# EAGLE design MQ-135_Matheus_Rossetti_-_14205347 (EAGLE 9.6.2)
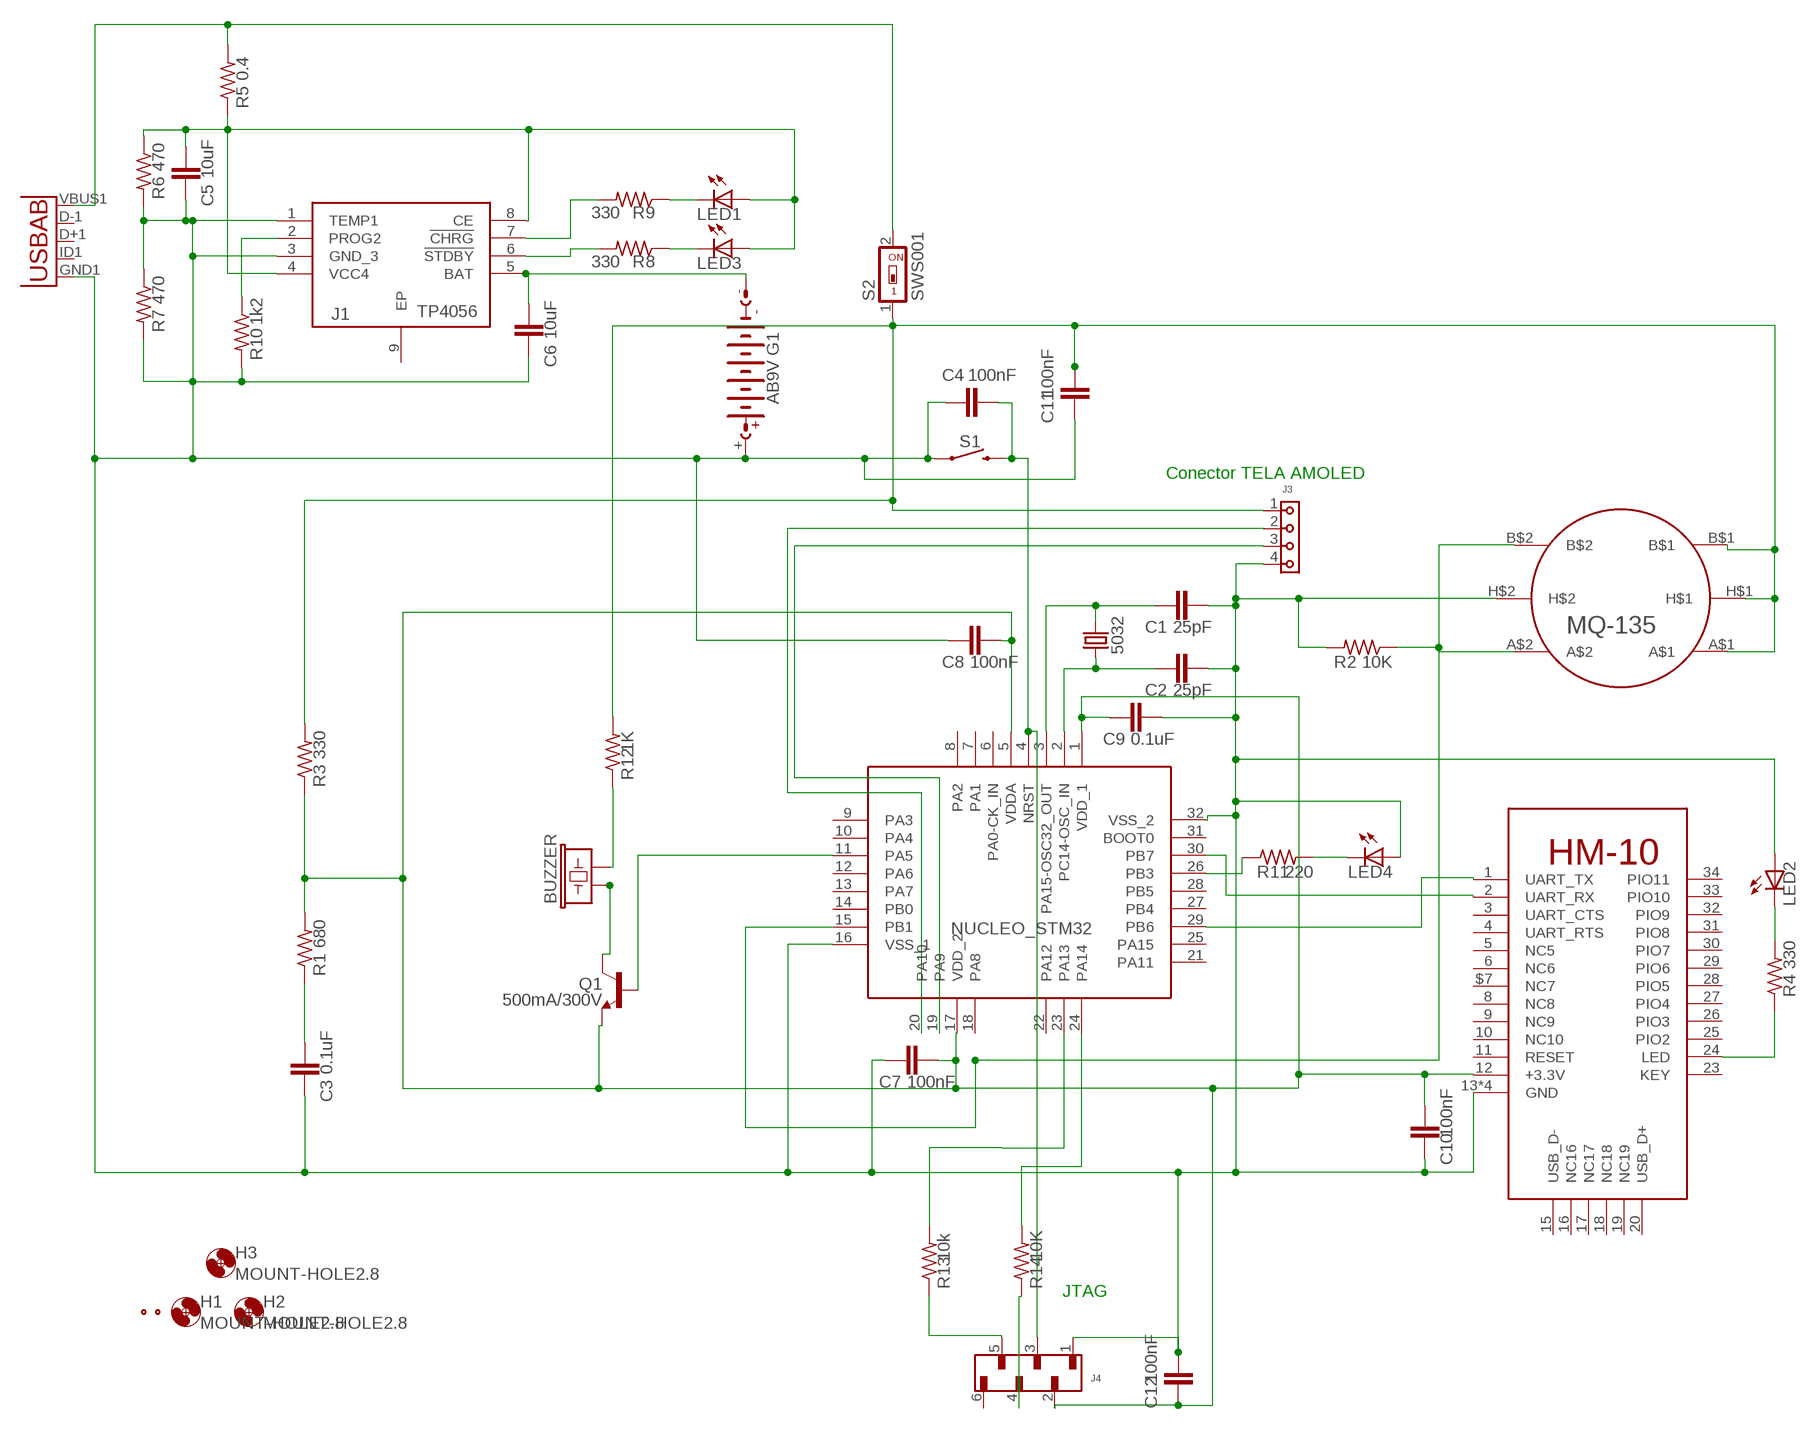
[diagram p0: schematic, sheet 1]

## Parts
BT_SENSOR  HM-10-BOARD  [26.9X13X2.2_BOARD]
C1  25pF  CC0805KRX7R9BB104  [CAP_0805]
C2  25pF  CC0805KRX7R9BB104  [CAP_0805]
C3  0.1uF  CC0805KRX7R9BB104  [CAP_0805]
C4  100nF  CC0805KRX7R9BB104  [CAP_0805]
C5  10uF  CC0805KRX7R9BB104  [CAP_0805]
C6  10uF  CC0805KRX7R9BB104  [CAP_0805]
C7  100nF  CC0805KRX7R9BB104  [CAP_0805]
C8  100nF  CC0805KRX7R9BB104  [CAP_0805]
C9  0.1uF  CC0805KRX7R9BB104  [CAP_0805]
C10  100nF  CC0805KRX7R9BB104  [CAP_0805]
C11  100nF  CC0805KRX7R9BB104  [CAP_0805]
C12  100nF  CC0805KRX7R9BB104  [CAP_0805]
G1  AB9V  [AB9V]
H1  MOUNT-HOLE2.8  [2,8]
H2  MOUNT-HOLE2.8  [2,8]
H3  MOUNT-HOLE2.8  [2,8]
J1  TP4056  [SOIC127P600X175-9N]
J3  6130XX11821_61300411821  [61300411821]
J4  6100XX18221_61000618221  [61000618221]
LED1  LEDCHIP-LED0805  [CHIP-LED0805]
LED2  LEDCHIP-LED0805  [CHIP-LED0805]
LED3  LEDCHIP-LED0805  [CHIP-LED0805]
LED4  LEDCHIP-LED0805  [CHIP-LED0805]
LS4  BUZZER  BUZZER-SMD_KIT  [BUZZER-CCV-KIT]
NUCLEO_STM32  STM32  STM32L031K6T6TR  [QFP80P900X900X160-32N]
Q1  500mA/300V  TRANS_NPN-MMBTA42  [SOT23-3]
R1  680  CRCW08050000Z0EA  [RES_0805]
R2  10K  CRCW08050000Z0EA  [RES_0805]
R3  330  CRCW08050000Z0EA  [RES_0805]
R4  330  CRCW08050000Z0EA  [RES_0805]
R5  0.4  CRCW08050000Z0EA  [RES_0805]
R6  470  CRCW08050000Z0EA  [RES_0805]
R7  470  CRCW08050000Z0EA  [RES_0805]
R8  330  CRCW08050000Z0EA  [RES_0805]
R9  330  CRCW08050000Z0EA  [RES_0805]
R10  1k2  CRCW08050000Z0EA  [RES_0805]
R11  220  CRCW08050000Z0EA  [RES_0805]
R12  1K  CRCW08050000Z0EA  [RES_0805]
R13  10k  CRCW08050000Z0EA  [RES_0805]
R14  10K  CRCW08050000Z0EA  [RES_0805]
S1  MOMENTARY-SWITCH-SPST-SMD-6.0X3.5MM  [TACTILE_SWITCH_SMD_6.0X3.5MM]
S2  SWS001  [SMS-001]
U1  USB""  [USB-MICRO-SMD]
U$1  MQ_135_A  [MQ-135]
X1  FIDUCIAL_0.6-1.2MM  [FIDUCIAL0.6-1.2]
X2  5032  5032/2P  [5032/2P]
X3  FIDUCIAL_0.6-1.2MM  [FIDUCIAL0.6-1.2]

## Nets
3,3V: BT_SENSOR.12(+3.3V) C7.1 C8.1 C9.2 C10.1 C12.1 J4.2 NUCLEO_STM32.1(VDD_1) NUCLEO_STM32.5(VDDA) NUCLEO_STM32.17(VDD_2) Q1.2(E) R1.2 R3.1
5V: R5.2 S2.2 U1.VBUS1(VBUS)
5V-SWT: C11.2 J3.1 R3.2 R12.2 S2.1 U$1.A$1 U$1.B$1 U$1.H$1
ENTRADASENSOR: NUCLEO_STM32.15(PB1) R2.1 U$1.A$2 U$1.B$2
GND: BT_SENSOR.13(GND) BT_SENSOR.14(GND) BT_SENSOR.21(GND) BT_SENSOR.22(GND) C1.2 C2.2 C3.2 C4.1 C5.2 C6.1 C7.2 C8.2 C9.1 C10.2 C11.1 C12.2 G1.+ J1.1(TEMP1) J1.3(GND_3) J3.4 J4.1 LED2.A LED4.A NUCLEO_STM32.16(VSS_1) NUCLEO_STM32.32(VSS_2) R2.2 R6.2 R7.1 R7.2 R10.2 S1.1 U1.GND1(GND) U$1.H$2
N$1: NUCLEO_STM32.23(PA13) R13.2
N$2: NUCLEO_STM32.11(PA5) Q1.1(B)
N$3: NUCLEO_STM32.24(PA14) R14.2
N$4: J4.5 R13.1
N$5: NUCLEO_STM32.26(PB3) R11.1
N$6: BT_SENSOR.2(UART_RX) NUCLEO_STM32.30(PB7)
N$7: BT_SENSOR.24(LED) R4.1
N$8: C1.1 NUCLEO_STM32.3(PA15-OSC32_OUT) X2.2
N$9: C6.2 G1.- J1.5(BAT)
N$10: C2.1 NUCLEO_STM32.2(PC14-OSC_IN) X2.1
N$11: LED2.C R4.2
N$12: J3.2 NUCLEO_STM32.20(PA10)
N$13: C5.1 J1.4(VCC4) J1.8(CE) LED1.A LED3.A R5.1 R6.1
N$14: J4.4 R14.1
N$15: J3.3 NUCLEO_STM32.19(PA9)
N$16: J1.2(PROG2) R10.1
N$17: LED4.C R11.2
N$18: LS4.+ Q1.3(C)
N$19: C3.1 R1.1
N$20: LS4.- R12.1
N$21: BT_SENSOR.1(UART_TX) NUCLEO_STM32.29(PB6)
N$25: J1.6(!STDBY) R8.2
N$26: J1.7(!CHRG) R9.2
N$27: LED1.C R9.1
N$28: LED3.C R8.1
RST: C4.2 J4.3 NUCLEO_STM32.4(NRST) S1.2
Unconnected: BT_SENSOR.3(UART_CTS) BT_SENSOR.4(UART_RTS) BT_SENSOR.5(NC5) BT_SENSOR.6(NC6) BT_SENSOR.8(NC8) BT_SENSOR.9(NC9) BT_SENSOR.10(NC10) BT_SENSOR.11(RESET) BT_SENSOR.15(USB_D-) BT_SENSOR.16(NC16) BT_SENSOR.17(NC17) BT_SENSOR.18(NC18) BT_SENSOR.19(NC19) BT_SENSOR.20(USB_D+) BT_SENSOR.23(KEY) BT_SENSOR.25(PIO2) BT_SENSOR.26(PIO3) BT_SENSOR.27(PIO4) BT_SENSOR.28(PIO5) BT_SENSOR.29(PIO6) BT_SENSOR.30(PIO7) BT_SENSOR.31(PIO8) BT_SENSOR.32(PIO9) BT_SENSOR.33(PIO10) BT_SENSOR.34(PIO11) BT_SENSOR.$7(NC7) J1.9(EP) J4.6 NUCLEO_STM32.6(PA0-CK_IN) NUCLEO_STM32.7(PA1) NUCLEO_STM32.8(PA2) NUCLEO_STM32.9(PA3) NUCLEO_STM32.10(PA4) NUCLEO_STM32.12(PA6) NUCLEO_STM32.13(PA7) NUCLEO_STM32.14(PB0) NUCLEO_STM32.18(PA8) NUCLEO_STM32.21(PA11) NUCLEO_STM32.22(PA12) NUCLEO_STM32.25(PA15) NUCLEO_STM32.27(PB4) NUCLEO_STM32.28(PB5) NUCLEO_STM32.31(BOOT0) U1.D+1(D+) U1.D-1(D-) U1.ID1(USBID)

## Notes on the sheet
- Conector TELA AMOLED
- JTAG

## Library data of the parts
BT_SENSOR = hm10:HM-10: HM Bluetooth module use TI CC2540 or CC2541, Master and slave roles in one, transmission version and remote control version and PIO state acquisition functions in one, Support the AT command modify module parameters, Convenient and flexible.
C1-C12 = Resistor_Capacitor:CC0805KRX7R9BB104: CAP CER 0.1UF 50V X7R 0805 Manufacturer's datasheet <http://www.yageo.com/documents/recent/UPY-GPHC_X7R_6.3V-to-50V_18.pdf>; CREATED_BY: PCBLayout.com; DIGIKEY_PART_NUMBER: 311-1140-2-ND; MANUFACTURER: Yageo; MPN: CC0805KRX7R9BB104; PACKAGE: SMD 0805
G1 = battery:AB9V: 9-V BATTERY CLIP
H1-H3 = holes:MOUNT-HOLE: MOUNTING HOLE with drill center marker
J1 = SamacSys_Parts:TP4056: 1A Standalone Linear Li-lon Battery Charger, SOP-8 Source: Datasheet <https://dlnmh9ip6v2uc.cloudfront.net/datasheets/Prototyping/TP4056.pdf>; DESCRIPTION: 1A Standalone Linear Li-lon Battery Charger, SOP-8; HEIGHT: 1.75mm; MANUFACTURER_NAME: NanJing Top Power; MANUFACTURER_PART_NUMBER: TP4056
J3 = Wurth_Connectors_WR-PHD:6130XX11821_61300411821: WR-PHD 2.54 mm Socket Header ARTICLE PROPERTIES: Pins:1;​ 2;​ 3;​ 4;​ 5;​ 6;​ 7;​ 8;​ 9;​ 10;​ 12;​ 13;​ 14;​ 15;​ 16;​ 18;​ 20;​ 22;​ 24;​ 25;​ 32;​ 36;​ 40 KIND PROPERTIES: Pitch：2.54 mm Quality Class:3 as per CECC 75 301-802 Rows：Single Gender：Socket Header;​ Female Type：Straight MATERIAL PROPERTIES: Insulator Material :PBT Insulator Flammability Rating:UL94 V-0 Contact Material:Copper Alloy Contact Plating:Gold Contact Type:Stamped GENERAL INFORMATION Operating Temperature:-40 up to +125 °C Compliance:Lead free / RoHS ELECTRICAL PROPERTIES: Rated Current:3 A IR 1:3 A Withstanding Voltage:500 V (AC) Contact Resistance:20 mΩ RISO:1000 MΩ CERTIFICATION UL Approval:E323964 PACKAGING PROPERTIES Packaging:Tray <https://katalog.we-online.com/media/images/v2/o33218v209%20Family_WR-PHD_613xxx11821.jpg> Details see: https://katalog.we-online.com/en/em/PHD_2_54_SOCKET_HEADER_6130XX11821 Updated by Yingchun,Shan 2019-10-21 2019 (C) Würth Elektronik; DATASHEET-URL: https://katalog.we-online.com/em/datasheet/61300411821.pdf; GENDER: Socket Header; IR: 3A; MATES: WR-PHD 2.54mm SMT Pin Header/THT Angled Pin Header/THT Pin Header; PACKAGING: Tray; PART-NUMBER: 61300411821; PINS: 4; ROWS: Single; TYPE: Straight
J4 = Wurth_Connectors_WR-PHD:6100XX18221_61000618221: WR-PHD 2.54 mm SMT Pin Header ARTICLE PROPERTIES: Pins:4;​ 6;​ 10;​ 14;​ 16;​ 24;​ 32;​ 34;​ 36 KIND PROPERTIES: Pitch：2.54 mm Quality Class:3 as per CECC 75 301-802 Rows：Single Gender：Pin Header Type：Straight Type 1;​ Straight Type 2 MATERIAL PROPERTIES: Insulator Material :PA6T Insulator Flammability Rating:UL94 V-0 Contact Material:Copper Alloy Contact Plating:Gold Contact Type:Stamped GENERAL INFORMATION Operating Temperature:-40 up to +125 °C Compliance:Lead free / RoHS ELECTRICAL PROPERTIES: Rated Current:3 A IR 1:3 A Withstanding Voltage:500 V (AC) Contact Resistance:20 mΩ RISO:1000 MΩ CERTIFICATION UL Approval:E323964 PACKAGING PROPERTIES Packaging:Tube <https://katalog.we-online.com/media/images/v2/o33202v209%20Family_WR-PHD_6100xx18221.jpg> Details see: https://katalog.we-online.com/en/em/PHD_2_54_SMT_PIN_HEADER_6100XX18X21 Updated by Yingchun,Shan 2019-10-18 2019 (C) Würth Elektronik; DATASHEET-URL: https://katalog.we-online.com/em/datasheet/61000618221.pdf; GENDER: Pin Header; IR: 3A; MATES: WR-PHD 2.54mm Angled Socket Header/SMT Socket Header/Socket Header/Socket Header Bottom Entry; PACKAGING: Tube; PART-NUMBER: 61000618221; PINS: 6; ROWS: Single; TYPE: Straight Type 1
LED1-LED4 = Fidget Spinner Example:LED: LED OSRAM: - CHIPLED LG R971, LG N971, LY N971, LG Q971, LY Q971, LO R971, LY R971 LH N974, LH R974 LS Q976, LO Q976, LY Q976 LO Q996 - Hyper CHIPLED LW Q18S LB Q993, LB Q99A, LB R99A - SideLED LS A670, LO A670, LY A670, LG A670, LP A670 LB A673, LV A673, LT A673, LW A673 LH A674 LY A675 LS A676, LA A676, LO A676, LY A676, LW A676 LS A679, LY A679, LG A679 - Hyper Micro SIDELED® LS Y876, LA Y876, LO Y876, LY Y876 LT Y87S - SmartLED LW L88C, LW L88S LB L89C, LB L89S, LG L890 LS L89K, LO L89K, LY L89K LS L896, LA L896, LO L896, LY L896 - TOPLED LS T670, LO T670, LY T670, LG T670, LP T670 LSG T670, LSP T670, LSY T670, LOP T670, LYG T670 LG T671, LOG T671, LSG T671 LB T673, LV T673, LT T673, LW T673 LH T674 LS T676, LA T676, LO T676, LY T676, LB T676, LH T676, LSB T676, LW T676 LB T67C, LV T67C, LT T67C, LS T67K, LO T67K, LY T67K, LW E67C LS E67B, LA E67B, LO E67B, LY E67B, LB E67C, LV E67C, LT E67C LW T67C LS T679, LY T679, LG T679 LS T770, LO T770, LY T770, LG T770, LP T770 LB T773, LV T773, LT T773, LW T773 LH T774 LS E675, LA E675, LY E675, LS T675 LS T776, LA T776, LO T776, LY T776, LB T776 LHGB T686 LT T68C, LB T68C - Hyper Mini TOPLED® LB M676 - Mini TOPLED Santana® LG M470 LS M47K, LO M47K, LY M47K Source: http://www.osram.convergy.de LUXEON: - LUMILED® LXK2-PW12-R00, LXK2-PW12-S00, LXK2-PW14-U00, LXK2-PW14-V00 LXK2-PM12-R00, LXK2-PM12-S00, LXK2-PM14-U00 LXK2-PE12-Q00, LXK2-PE12-R00, LXK2-PE12-S00, LXK2-PE14-T00, LXK2-PE14-U00 LXK2-PB12-K00, LXK2-PB12-L00, LXK2-PB12-M00, LXK2-PB14-N00, LXK2-PB14-P00, LXK2-PB14-Q00 LXK2-PR12-L00, LXK2-PR12-M00, LXK2-PR14-Q00, LXK2-PR14-R00 LXK2-PD12-Q00, LXK2-PD12-R00, LXK2-PD12-S00 LXK2-PH12-R00, LXK2-PH12-S00 LXK2-PL12-P00, LXK2-PL12-Q00, LXK2-PL12-R00 Source: www.luxeon.com KINGBRIGHT: KA-3528ASYC Source: www.kingbright.com
LS4 = SparkFun-Electromechanical:BUZZER: Buzzer Small round buzzers that operate around the audible 2kHz range. You can use these as speakers to create simple music or user interfaces. Variant Overview: PTH - Mini Speaker - PC Mount 12mm 2.048kHz <https://www.sparkfun.com/products/7950> PTH_KIT - Mini Speaker - PC Mount 12mm 2.048kHz <https://www.sparkfun.com/products/7950> KIT simplifies soldering by adding stop mask to one side of the pads. PTH_NO_SILK - Mini Speaker - PC Mount 12mm 2.048kHz <https://www.sparkfun.com/products/7950> No silkscreen indicator of buzzer outline. PTH_KIT_NO_SILK - Mini Speaker - PC Mount 12mm 2.048kHz <https://www.sparkfun.com/products/7950> KIT package w/o silkscreen SMD - Buzzer Audio Magnetic (CCV-084B16) SMD buzzer used on, e.g. the LilyPad Buzzer <https://www.sparkfun.com/products/8463> and RFID USB Reader <https://www.sparkfun.com/products/9963>. SMD_KIT - Buzzer Audio Magnetic (CCV-084B16) SMD Buzzer with elongated pins to make soldering easier. Used on the SparkFun Simon Says - Surface Mount Soldering Kit <https://www.sparkfun.com/products/10935>.; PROD_ID: COMP-08568
NUCLEO_STM32 = STM32L031K6T6TR:STM32L031K6T6TR: STMICROELECTRONICS - STM32L031K6T6TR - ARM MCU, STM32 Family STM32L0 Series Microcontrollers, ARM Cortex-M0+, 32bit, 32 MHz, 32 KB, 8 KB Source: Datasheet <https://4donline.ihs.com/images/VipMasterIC/IC/SGST/SGST-S-A0002219924/SGST-S-A0002219924-1.pdf?hkey=6D3A4C79FDBF58556ACFDE234799DDF0>; ARROW_PART_NUMBER: STM32L031K6T6TR; ARROW_PRICE-STOCK: https://www.arrow.com/en/products/stm32l031k6t6tr/stmicroelectronics; DESCRIPTION: STMICROELECTRONICS - STM32L031K6T6TR - ARM MCU, STM32 Family STM32L0 Series Microcontrollers, ARM Cortex-M0+, 32bit, 32 MHz, 32 KB, 8 KB; HEIGHT: 1.6mm; MANUFACTURER_NAME: STMicroelectronics; MANUFACTURER_PART_NUMBER: STM32L031K6T6TR; MOUSER_PART_NUMBER: 511-STM32L031K6T6TR; MOUSER_PRICE-STOCK: https://www.mouser.co.uk/ProductDetail/STMicroelectronics/STM32L031K6T6TR/?qs=xwQlLnDx56Cmxri8cgW0QQ%3D%3D
Q1 = SparkFun-DiscreteSemi:TRANS_NPN: NPN transistor Current controlled devices typically used to amplify current or used as a switch. BC547 - COM-08928 <http://www.sparkfun.com/products/8928> (TO-92 45V 100mA) (1.Collector 2.Base 3.Emitter) 2N3904 - COM-00521 <http://www.sparkfun.com/products/521> (TO-92 40V 200mA) (1.Emitter 2.Base 3.Collector) P2N2222A - COM-12852 <http://www.sparkfun.com/products/12852> (TO-92 40V 600mA) (1.Collector 2.Base 3.Emitter); PROD_ID: TRANS-09116
R1-R7 R10-R14 = Resistor_Capacitor:CRCW08050000Z0EA: RES SMD 0 OHM JUMPER 1/8W 0805 Manufacturer's datasheet <http://www.vishay.com/docs/20035/dcrcwe3.pdf>; CREATED_BY: PCBLayout.com; DIGIKEY_PART_NUMBER: 541-0.0ATR-ND; MANUFACTURER: Vishay Dale; MPN: CRCW08050000Z0EA; PACKAGE: SMD 0805
R8 R9 = Resistor_Capacitor:CRCW08050000Z0EA: RES SMD 0 OHM JUMPER 1/8W 0805 Manufacturer's datasheet <http://www.vishay.com/docs/20035/dcrcwe3.pdf>; CREATED_BY: PCBLayout.com; DIGIKEY_PART_NUMBER: 541-0.0ATR-ND; MANUFACTURER: Vishay Dale; MPN: CRCW08050000Z0EA; PACKAGE: SMD 0805; SPICEPREFIX: R
S1 = SparkFun-Switches:MOMENTARY-SWITCH-SPST: Momentary Switch (Pushbutton) - SPST Normally-open (NO) SPST momentary switches (buttons, pushbuttons). Variants PTH-12MM - 12mm square, through-hole Momentary Pushbutton Switch - 12mm Square <https://www.sparkfun.com/products/9190> (COM-09190) PTH-6.0MM, PTH-6.0MM-KIT - 6.0mm square, through-hole Mini Pushbutton Switch <https://www.sparkfun.com/products/97> (COM-00097) KIT package intended for soldering kit's - only one side of pads' copper is exposed. PTH-RIGHT-ANGLE-KIT - Right-angle, through-hole Right Angle Tactile Button <https://www.sparkfun.com/products/10791> - Used on SparkFun BigTime Watch Kit <https://www.sparkfun.com/products/11734> SMD-12MM - 12mm square, surface-mount Tactile Button - SMD (12mm) <https://www.sparkfun.com/products/12993> (COM-12993) Used on SparkFun PicoBoard <https://www.sparkfun.com/products/11888> SMD-4.5MM - 4.5mm Square Trackball Switch Used on SparkFun Blackberry Trackballer Breakout <https://www.sparkfun.com/products/13169> SMD-4.6MMX2.8MM - 4.60mm x 2.80mm, surface mount Used on SparkFun SAMD21 Mini Breakout <https://www.sparkfun.com/products/13664> SMD-5.2MM, SMD-5.2-REDUNDANT - 5.2mm square, surface-mount Mini Pushbutton Switch - SMD <https://www.sparkfun.com/products/8720> (COM-08720) Used on Arduino Pro Mini <https://www.sparkfun.com/products/11114> REDUNDANT package connects both switch circuits together SMD-6.0X3.5MM - 6.0 x 3.5mm, surface mount Momentary Reset Switch SMD <https://www.sparkfun.com/products/8229> (COM-08229) SMD-6.2MM-TALL - 6.2mm square, surface mount Tactile Button - SMD (6mm) <https://www.sparkfun.com/products/12992> Used on SparkFun Digital Sandbox <https://www.sparkfun.com/products/12651> SMD-RIGHT-ANGLE - Right-angle, surface mount Used on SparkFun Block for Intel® Edison - Arduino <https://www.sparkfun.com/products/13036>; PROD_ID: SWCH-00815; SF_SKU: COM-08229
S2 = smd-special:SWS001: SMD Dip Switch 1 pol.
U1 = MicroUSB:USB: This is a USB AB connector that is compatible with USB OTG. i.e. this connector can serve as a host or device
U$1 = MQ_135_A:MQ_135_A
X1 X3 = nxp_60:FIDUCIAL_0.6-1.2MM
X2 = Crystals_Oscillators:5032/2P: Crystal Manufacturer's datasheet <https://datasheet.octopart.com/5032-2P-Xinhunjing-datasheet-30677175.pdf>; CREATED_BY: PCBLayout.com; MANUFACTURER: Xinhunjing; MPN: 5032/2P; PACKAGE: SMD

## Board
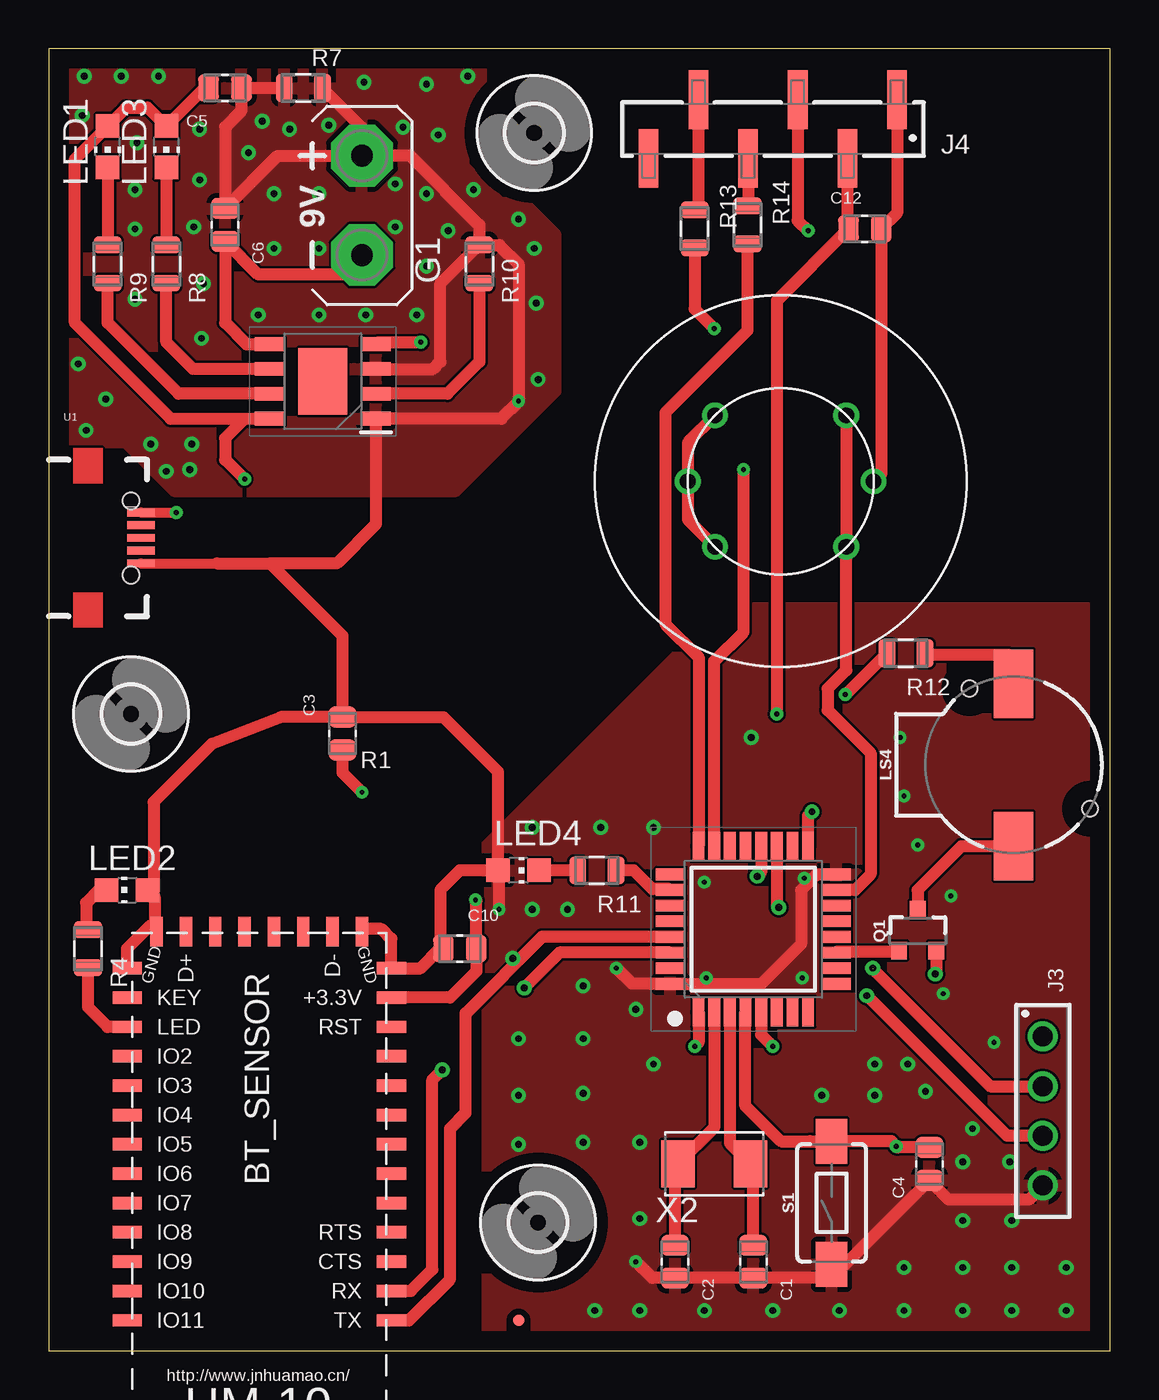
[diagram p1: board, top side]
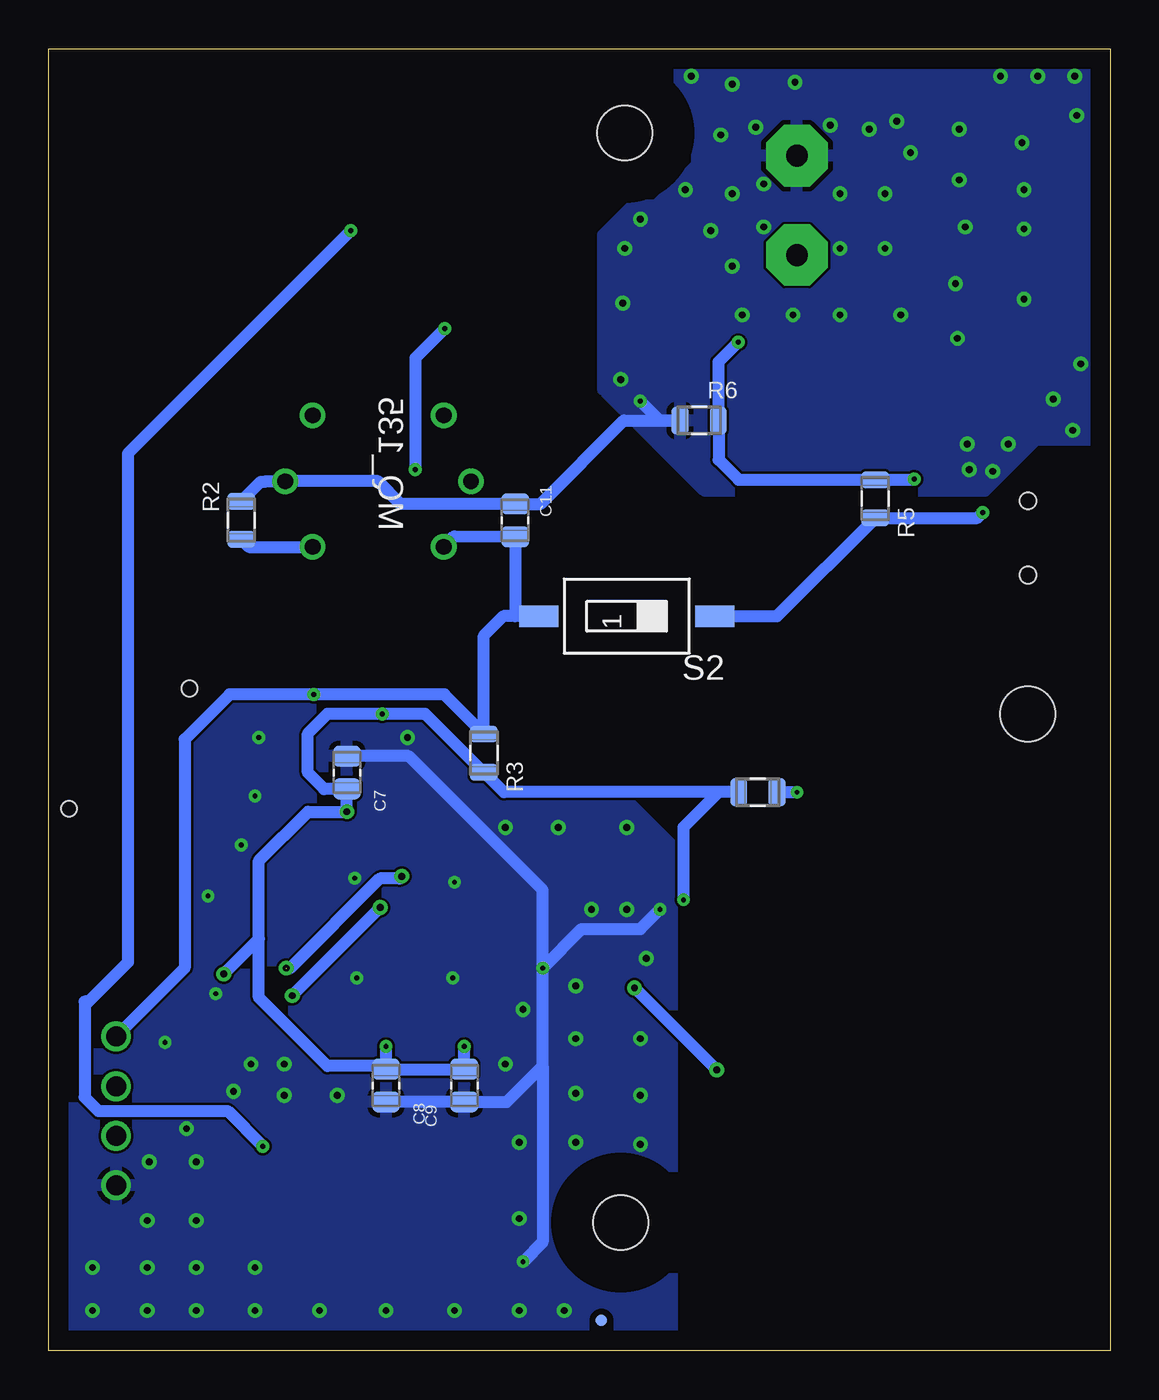
[diagram p2: board, bottom side, seen from below]

Size 54.23 x 66.55 mm. Coordinates in mm from the lower left corner, seen from the top.
Outline: 0,0 54.23,0 54.23,66.55 0,66.55 0,0
Copper layers (1*16): Top 0.035mm / dielectric 1.5mm / Bottom 0.035mm
Design rules "default *": minimum track width 6mil, minimum drill 0.35mm, track to track 5mil, track to pad 6mil, pad to pad 6mil, via to via 6mil, smd to smd 6mil, copper to edge 40mil, drill to drill 6mil, minimum pad ring 10mil, minimum via ring 8mil, stop-mask expansion 4mil, vias tented up to drill 0mil, thermal gap 10mil

### Footprints (pad centres in the part's own frame; a part is rotated, then mirrored left to right if it is on the bottom)
26.9X13X2.2_BOARD = smd 1.5 x 0.635: 1 -7.5,0; 2 -7.5,-1.5; 3 -7.5,-3; 4 -7.5,-4.5; 5 -7.5,-6; 6 -7.5,-7.5; 8 -7.5,-10.5; 9 -7.5,-12; 10 -7.5,-13.5; 11 -7.5,-15; 12 -7.5,-16.5; 13 -7.5,-18; 22 6,-18; 23 6,-16.5; 24 6,-15; 25 6,-13.5; 26 6,-12; 27 6,-10.5; 28 6,-9; 29 6,-7.5; 30 6,-6; 31 6,-4.5; 32 6,-3; 33 6,-1.5; 34 6,0; $7 -7.5,-9 | smd 0.635 x 1.5: 14 -6,-19.875; 15 -4.5,-19.875; 16 -3,-19.875; 17 -1.5,-19.875; 18 0,-19.875; 19 1.5,-19.875; 20 3,-19.875; 21 4.5,-19.875
CAP_0805 = smd 1.05 x 1.38: 1 -0.84,0; 2 0.84,0
AB9V = drill 1.118 pad 3.15 octagon: + 0,2.54; - 0,-2.54
2,8 = hole 2.8: 0,0
SOIC127P600X175-9N = smd 1.525 x 0.7: 1 -2.712,1.905; 2 -2.712,0.635; 3 -2.712,-0.635; 4 -2.712,-1.905; 5 2.712,-1.905; 6 2.712,-0.635; 7 2.712,0.635; 8 2.712,1.905 | smd 2.513 x 3.402: 9 0,0
61300411821 = drill 1.02: 1 -3.81,0; 2 -1.27,0; 3 1.27,0; 4 3.81,0
61000618221 = smd 1 x 3: 1 -6.35,-1.5; 2 -3.81,1.5; 3 -1.27,-1.5; 4 1.27,1.5; 5 3.81,-1.5; 6 6.35,1.5
CHIP-LED0805 = smd 1.2 x 1.2: A 0,-1.05; C 0,1.05
BUZZER-CCV-KIT = smd 3.5 x 2: + 4.15,0; - -4.15,0 | hole 0.8: -3.9,-2.25; 2.25,3.9
QFP80P900X900X160-32N = smd 1.475 x 0.6: 1 -4.238,2.8; 2 -4.238,2; 3 -4.238,1.2; 4 -4.238,0.4; 5 -4.238,-0.4; 6 -4.238,-1.2; 7 -4.238,-2; 8 -4.238,-2.8; 17 4.238,-2.8; 18 4.238,-2; 19 4.238,-1.2; 20 4.238,-0.4; 21 4.238,0.4; 22 4.238,1.2; 23 4.238,2; 24 4.238,2.8 | smd 0.6 x 1.475: 9 -2.8,-4.238; 10 -2,-4.238; 11 -1.2,-4.238; 12 -0.4,-4.238; 13 0.4,-4.238; 14 1.2,-4.238; 15 2,-4.238; 16 2.8,-4.238; 25 2.8,4.238; 26 2,4.238; 27 1.2,4.238; 28 0.4,4.238; 29 -0.4,4.238; 30 -1.2,4.238; 31 -2,4.238; 32 -2.8,4.238
SOT23-3 = smd 0.8 x 0.9: 1 -0.95,-1; 2 0.95,-1; 3 0,1.1
RES_0805 = smd 0.87 x 1.42: 1 -0.975,0; 2 0.975,0
TACTILE_SWITCH_SMD_6.0X3.5MM = smd 2.3 x 1.6: 1 -3.15,0; 2 3.15,0
SMS-001 = smd 1.092 x 2.007: 1 0,-4.496; 2 0,4.496
USB-MICRO-SMD = smd 1.4 x 0.4: D+1 2.7,0; D-1 2.7,0.65; GND1 2.7,-1.3; ID1 2.7,-0.65; VBUS1 2.7,1.3 | hole 0.85: 2.2,1.9; 2.2,-1.9
MQ-135 = drill 0.8: A$1 -3.36,3.35; A$2 -3.36,-3.35; B$1 3.36,3.35; B$2 3.36,-3.35; H$1 0,4.75; H$2 0,-4.75
FIDUCIAL0.6-1.2 = smd 0.6 x 0.6: 1 0,0
5032/2P = smd 1.7 x 2.4: 1 -1.85,0; 2 1.85,0

### Placement (x,y rotation side)
BT_SENSOR  10,1.55 180 top
C1  36,4.55 270 top
C2  32,4.55 270 top
C3  15,31.55 90 top
C4  45,9.55 90 top
C5  9,64.55 0 top
C6  9,57.55 270 top
C7  39,29.55 90 bottom
C8  37,13.55 270 bottom
C9  33,13.55 90 bottom
C10  21,20.55 180 top
C11  30.4,42.45 270 bottom
C12  41.7,57.35 0 top
G1  16,58.55 0 top
H1  4.2,32.55 0 top
H2  24.8,62.25 0 top
H3  25,6.55 0 top
J1  14,49.55 180 top
J3  50.8,12.25 270 top
J4  37,62.45 180 top
LED1  3,61.55 180 top
LED2  4,23.55 90 top
LED3  6,61.55 180 top
LED4  24,24.55 270 top
LS4  49.3,29.95 270 top
NUCLEO_STM32  36,21.55 90 top
Q1  44.4,21.45 0 top
R1  18,28.55 180 bottom
R2  44.4,42.45 90 bottom
R3  32,30.55 90 bottom
R4  2,20.55 90 top
R5  12,43.55 270 bottom
R6  21,47.55 180 bottom
R7  13,64.55 0 top
R8  6,55.55 270 top
R9  3,55.55 270 top
R10  22,55.55 90 top
R11  28,24.55 180 top
R12  43.8,35.65 180 top
R13  33,57.35 270 top
R14  35.7,57.55 270 top
S1  40,7.55 90 top
S2  24.7,37.55 270 bottom
U1  2,41.55 0 top
U$1  37.4,44.45 90 top
X1  24,1.55 0 top
X2  34,9.55 0 top
X3  26,1.55 0 bottom

### Tracks (layer width: path | path; a pad name or v marks a point on that pad's centre or on a via)
3,3V  (via drill 0.25, 0.35)
  Top 0.61: NUCLEO_STM32.1 33.2,15.75 v33,15.55 | NUCLEO_STM32.5 36.4,16.15 v37,15.55 | NUCLEO_STM32.17 38.8,27.35 v39,27.55 | v21.8,23.05 21.84,23.01 C10.1 21.84,19.39 20.5,18.05 BT_SENSOR.12 | J4.2 40.81,57.4 C12.1 37.2,53.69 v37.2,32.55 | Q1.2 45.35,19.3 v45.3,19.25
  Bottom 0.61: v33,15.55 C9.2 C8.1 | C8.1 v37,15.55 | C8.1 37.16,14.55 40,14.55 43.5,18.05 43.5,21.05 | 43.5,21.05 43.5,25.05 41,27.55 v39,27.55 C7.1 40.16,28.71 41,29.55 41,31.55 40,32.55 v37.2,32.55 35,32.55 32.02,29.58 R3.1 30.98,28.55 R1.2 20,28.55 21.8,26.75 v21.8,23.05 | 43.5,21.05 v45.3,19.25
5V  (via drill 0.25)
  Top 0.508: U1.VBUS1 v6.5,42.85
  Bottom 0.61: S2.2 17.02,37.55 R5.2 6.78,42.58 v6.5,42.85
5V-SWT  (via drill 0.25)
  Top 0.61: U$1.B$1 32.65,46.41 U$1.H$1 32.65,42.49 U$1.A$1 | R12.2 40.73,33.55 v40.7,33.55
  Bottom 0.61: J3.1 47.3,19.56 47.3,31.25 45,33.55 v40.7,33.55 34.02,33.55 R3.2 32,36.55 31,37.55 30.4,37.55 | C11.2 33.5,41.64 U$1.A$1 | C11.2 | S2.1 30.4,37.55 | C11.2 30.4,37.55
ENTRADASENSOR
  Top 0.61: U$1.B$2 U$1.A$2 40.75,34.79 39.8,33.84 39.8,32.75 42,30.55 42,24.35 41.2,23.55 NUCLEO_STM32.15
  Bottom 0.61: R2.1 44.02,41.09 U$1.A$2
GND  (via drill 0.25, 0.35)
  Top 0.508: U1.GND1 8.6,40.25
  Top 0.61: R10.2 22,57.55 18.46,61.09 G1.+ | G1.+ 11.7,61.09 C6.1 9,62.55 9.84,63.39 C5.2 R7.1 | R7.2 16,62.52 G1.+ | J1.3 19.64,50.19 20,50.55 20,54.55 21.98,56.52 R10.2 | J3.4 50.07,7.71 46,7.71 C4.1 40.69,4.4 S1.1 39.31,3.71 C1.2 C2.2 30.84,3.71 v30,4.55 | C3.2 11.85,32.39 8.34,31.03 5.35,28.04 5.35,23.45 5.15,23.45 LED2.A 5.4,23.2 5.4,21.52 BT_SENSOR.21 5.19,21.74 4,20.55 BT_SENSOR.22 | BT_SENSOR.14 16.12,21.55 17,21.55 17.5,21.05 BT_SENSOR.13 19,19.55 20,20.55 C10.2 20,20.71 20,23.55 21,24.55 LED4.A | C3.2 20.16,32.39 22.95,29.6 LED4.A | R10.2 23.02,56.52 24,55.55 v24,48.55 24,48.52 23.12,47.64 J1.1 16.71,42.26 14.7,40.25 11.3,40.25 | 11.3,40.25 15,36.55 C3.2 | LED4.A 23,24.5 v23,22.55 | v29,19.55 29.8,18.75 NUCLEO_STM32.32 36.4,18.75 38.44,20.79 38.44,23.55 39.24,24.35 NUCLEO_STM32.16 | 8.6,40.25 11.3,40.25 | J4.1 43.35,58.16 C12.2 42.54,44.84 U$1.H$2
  Bottom 0.61: C8.2 C9.1 30.84,12.71 29,14.55 | 29,14.55 v29,19.55 | v29,19.55 29,23.55 35.84,30.39 C7.2 | R2.2 43.4,44.42 43.17,44.42 43.15,44.45 U$1.H$2 37.4,44.45 36.24,43.29 C11.1 29.1,43.29 24.84,47.55 R6.2 23,47.55 v24,48.55 | v30,4.55 29,5.55 29,14.55 | v29,19.55 27,21.55 24,21.55 v23,22.55
  other vias: 1.8,65.15 3.7,65.15 5.6,65.15 1.7,63.15 7.7,62.45 16.1,64.85 19.3,64.75 19.9,62.15 21.7,59.35 24,57.85 24.8,56.35 10.9,62.85 10.2,61.25 12.3,62.45 7.7,59.85 7.4,57.45 7.9,54.55 7.8,51.75 4.5,61.75 4.4,59.35 4.4,57.35 4.4,53.75 1.5,50.45 2.9,48.65 5.2,46.35 7.3,46.35 1.9,47.05 7.2,45.05 6,44.95 14.3,62.65 18.1,62.55 21.4,65.15 24.9,53.55 25,49.65 24.7,26.75 28.2,26.75 30.9,26.75 35.9,31.35 24.7,22.55 26.5,22.55 23.7,20.05 27.3,18.65 24,15.95 27.3,15.95 24,13.05 27.3,13.15 24,10.55 27.3,10.65 30,17.45 30.9,14.65 30.2,10.65 30.2,6.75 39.5,13.05 42.2,14.65 43.9,14.65 44.8,13.25 47.2,11.35 49.1,9.65 42.2,13.05 46.7,9.65 46.7,6.65 49.2,6.65 49.2,4.25 46.7,4.25 43.7,4.25 43.7,2.05 46.7,2.05 49.2,2.05 40.4,2.05 37,2.05 33.5,2.05 30.2,2.05 27.9,2.05 52,2.05 52,4.25 11.5,59.15 13.8,59.15 11.5,56.35 13.8,56.35 19.3,59.15 19.3,55.45 20.4,57.25 18.8,52.95 16.2,52.95 13.8,52.95 10.7,52.95 17.7,59.65 17.7,57.45 45.7,18.25 48.3,15.75 46.1,23.25 44.4,25.85 43.5,31.35 43.7,28.35 33.5,23.95 33.6,19.05 38.5,19.05 38.6,24.15
  pour Bottom: 51.6,0.35 53.7,0.35 54.2,-0.15 54.2,38.05 34.6,38.05 22.4,25.85 22.4,0.33 51.58,0.33
  pour Top: 22.4,0.35 54,0.35 54,37.75 53.8,37.95 35.1,37.95 34.9,37.75 34.3,37.75 22.4,25.85
  pour Top: 0.1,46.45 3.9,46.45 6.4,43.95 20.8,43.95 25.9,49.05 25.9,57.05 24.3,58.65 23.1,58.65 21.2,60.55 21.2,63.55 22.1,64.45 22.1,66.15 0.3,66.15 0.3,46.65
  pour Bottom: 0.3,46.55 3.8,46.55 6.4,43.95 20.7,43.95 25.7,48.95 25.9,49.15 25.9,57.05 24.4,58.55 24.3,58.55 23.2,58.55 21.3,60.45 21.1,60.65 21.1,63.55 22,64.45 22,64.75 22,66.15 0.4,66.15 0.3,66.05
N$1  (via drill 0.25)
  Top 0.61: R13.2 33,53.25 v34,52.25 | NUCLEO_STM32.23 34,35.25 35.5,36.75 v35.5,45.05
  Bottom 0.61: v34,52.25 35.5,50.75 v35.5,45.05
N$2
  Top 0.61: NUCLEO_STM32.11 40.28,20.39 43.39,20.39 Q1.1
N$3
  Top 0.61: R14.2 35.7,52.15 31.5,47.95 31.5,37.15 33.2,35.45 NUCLEO_STM32.24
N$4
  Top 0.61: J4.5 33.19,58.52 R13.1
N$5
  Top 0.61: NUCLEO_STM32.26 31.72,23.59 30.84,23.59 29.88,24.55 R11.1
N$6  (via drill 0.35)
  Top 0.61: NUCLEO_STM32.30 26.1,20.35 v24.3,18.55 | BT_SENSOR.2 18.5,3.05 19.6,4.15 19.6,13.85 v20.1,14.35
  Bottom 0.61: v20.1,14.35 v24.3,18.55
N$7
  Top 0.61: BT_SENSOR.24 3,16.55 2,17.55 R4.1
N$8
  Top 0.61: C1.1 36,9.4 X2.2 34.8,10.6 NUCLEO_STM32.3
N$9
  Top 0.61: J1.5 10.1,51.45 9,52.55 C6.2 10.7,55.01 15,55.01 G1.-
N$10
  Top 0.61: C2.1 32,9.4 X2.1 34,11.4 NUCLEO_STM32.2
N$11
  Top 0.61: R4.2 1.9,21.62 1.9,22.9 2.55,23.55 LED2.C
N$12  (via drill 0.35)  (1 unrouted)
  Top 0.61: J3.2 48.11,13.52 42.12,19.51 | NUCLEO_STM32.20 36.4,24.45 v36.2,24.25
  Bottom 0.61: v42.1,19.55 41.9,19.55 37.31,24.13 36.31,24.13 v36.2,24.25
N$13  (via drill 0.25)
  Top 0.61: v19,51.55 16.81,51.55 J1.4 | 10,47.64 6.23,47.64 1.32,52.55 1.32,60.92 LED1.A 3.95,63.55 5.05,63.55 LED3.A 7.95,64.55 C5.1 | 10,47.64 J1.8 | 10,47.64 9,46.64 9,45.55 v10,44.55
  Bottom 0.61: v19,51.55 20,50.55 20,47.58 R6.1 20,47.52 20,45.55 18.98,44.52 R5.1 10.03,44.52 v10,44.55
N$14
  Top 0.61: J4.4 35.73,58.55 R14.1
N$15  (via drill 0.35)
  Top 0.61: J3.3 48.97,10.98 v41.8,18.15 | NUCLEO_STM32.19 37.2,22.75 v37.3,22.65
  Bottom 0.61: v41.8,18.15 v37.3,22.65
N$16
  Top 0.61: R10.1 22,50.55 20.36,48.91 J1.2
N$17
  Top 0.61: R11.2 LED4.C
N$18
  Top 0.61: LS4.+ 46.65,25.8 44.4,23.55 Q1.3
N$19  (via drill 0.25)
  Top 0.61: v16,28.55 15,29.55 C3.1
  Bottom 0.61: R1.1 v16,28.55
N$20
  Top 0.61: R12.1 44.85,35.57 49.03,35.57 49.3,35.3 LS4.-
N$21
  Top 0.61: NUCLEO_STM32.29 25.2,21.15 21.3,17.25 21.3,12.15 20.5,11.35 20.5,3.65 18.4,1.55 BT_SENSOR.1
N$25
  Top 0.61: J1.6 7.37,50.19 6,51.55 R8.2
N$26
  Top 0.61: J1.7 6.63,48.91 3,52.55 R9.2
N$27
  Top 0.61: LED1.C R9.1
N$28
  Top 0.61: LED3.C R8.1
RST  (via drill 0.25)
  Top 0.61: NUCLEO_STM32.4 35.6,12.51 37.41,10.7 38.9,10.7 S1.2 40.9,10.7 43.05,10.7 v43.3,10.45 43.36,10.39 C4.2 | J4.3 38.27,57.78 v38.8,57.25
  Bottom 0.61: v38.8,57.25 50.2,45.85 50.2,19.85 52.2,17.85 52.4,17.85 52.4,12.95 51.7,12.25 45.1,12.25 v43.3,10.45